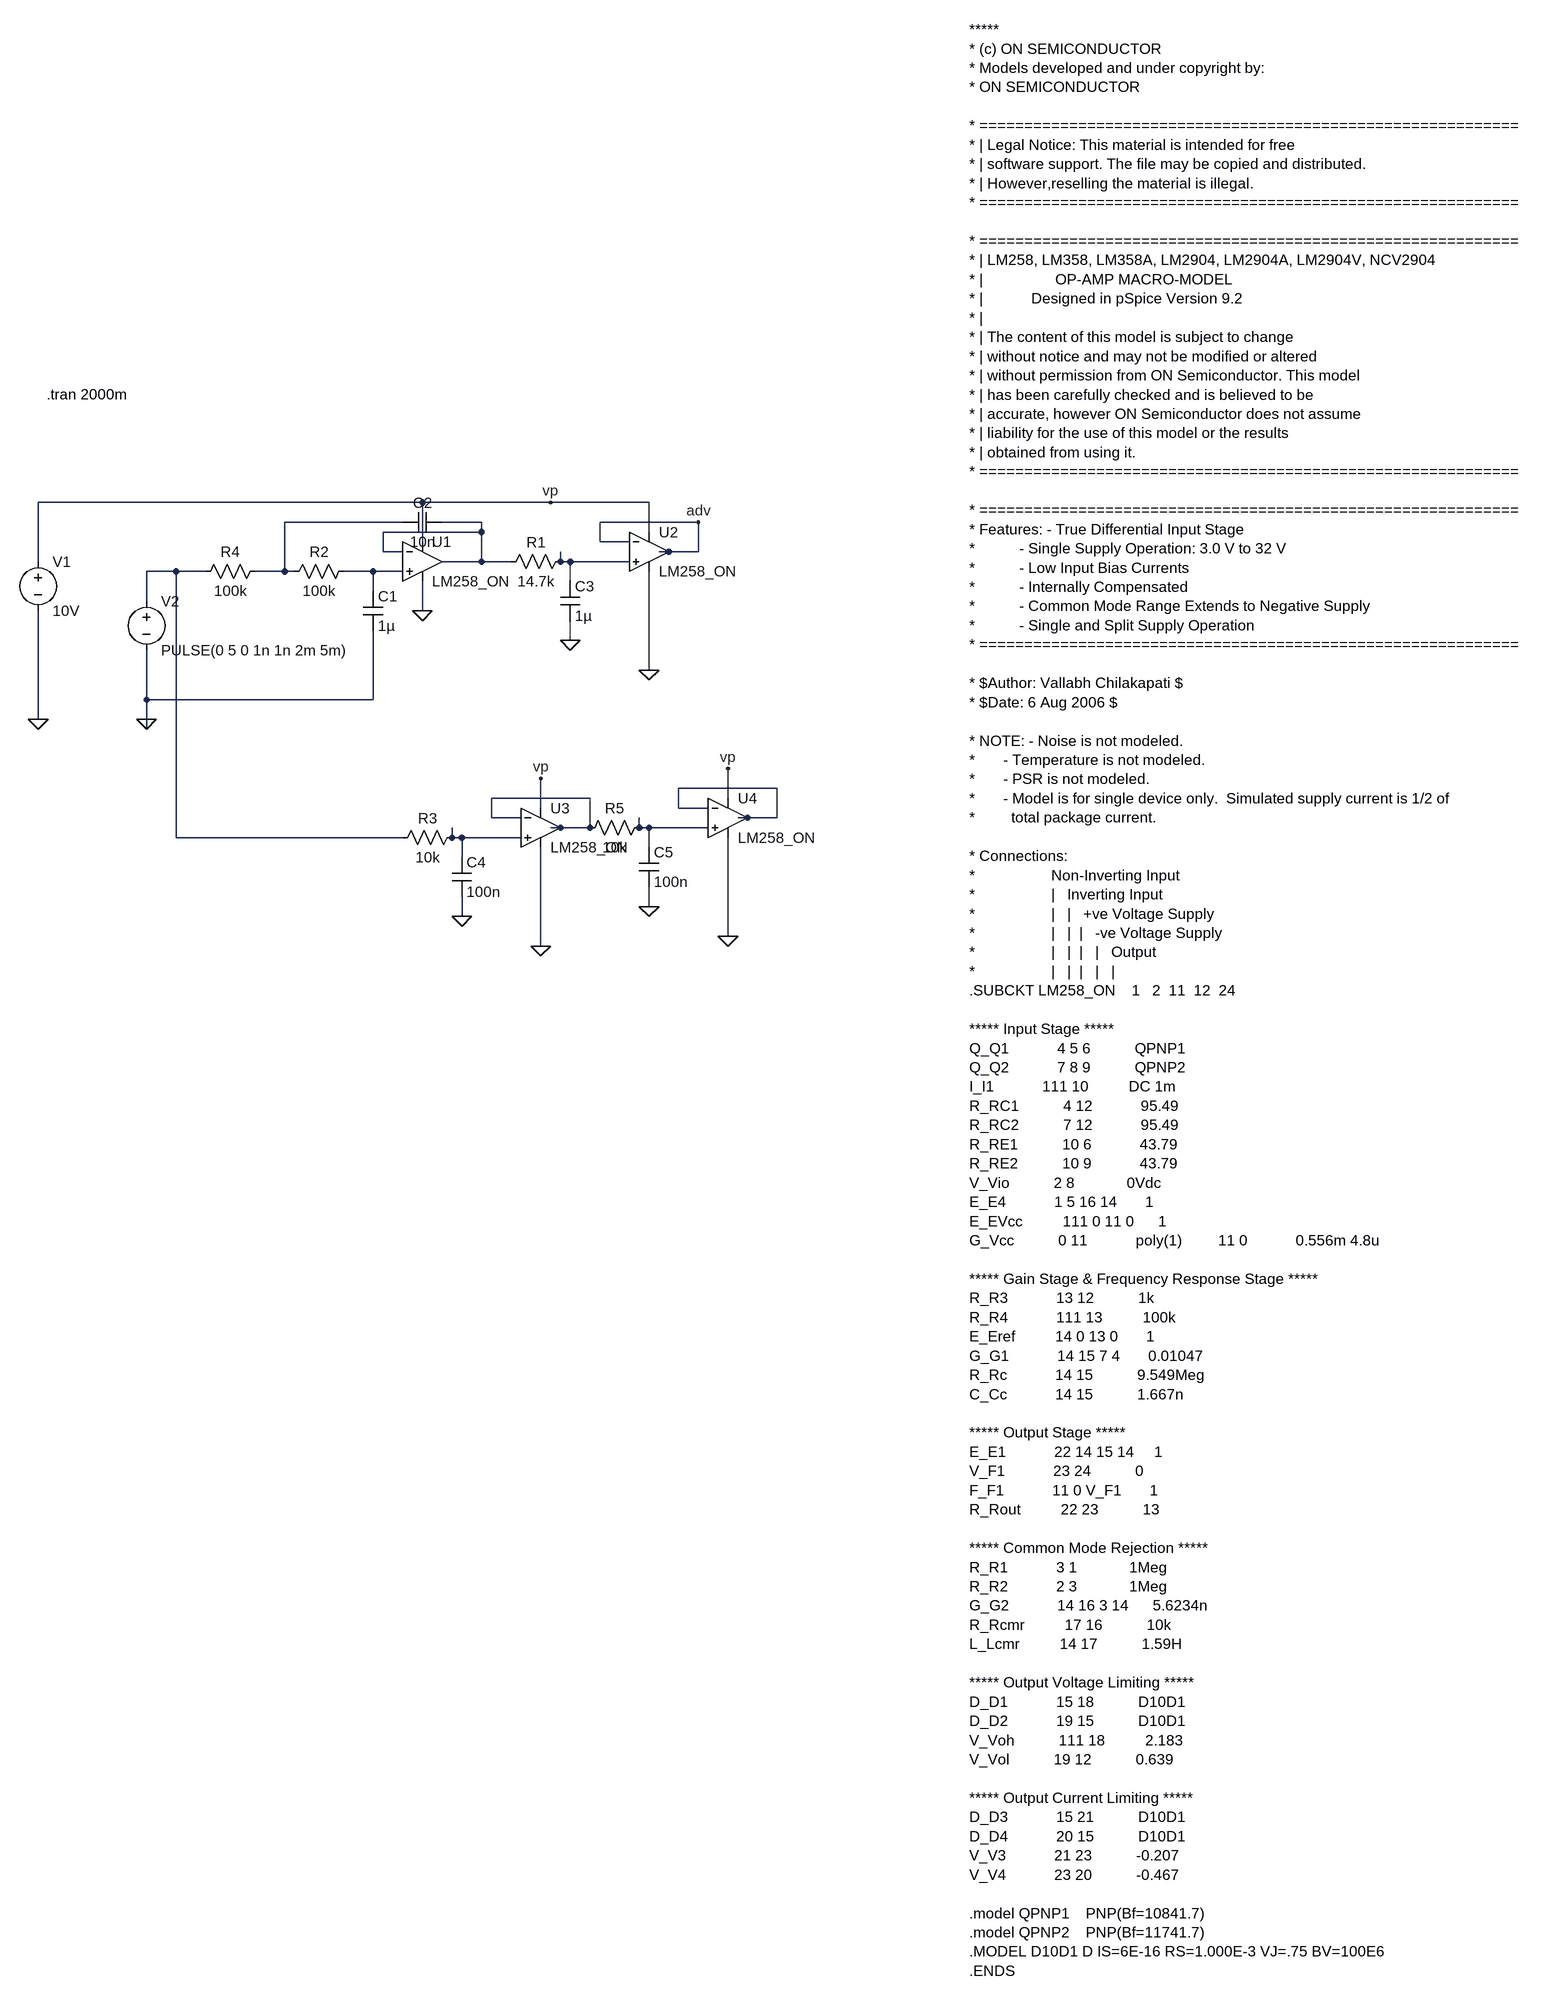
[diagram p0: schematic buckconverter_injection_filter.asc]
buckconverter_injection_filter.asc, the LTspice schematic file:
Version 4
SHEET 1 3056 2944
WIRE 1136 848 512 848
WIRE 1344 848 1136 848
WIRE 1504 848 1344 848
WIRE 1104 880 912 880
WIRE 1232 880 1168 880
WIRE 1584 880 1424 880
WIRE 1232 896 1232 880
WIRE 1232 896 1072 896
WIRE 1504 896 1504 848
WIRE 1136 912 1136 848
WIRE 1424 912 1424 880
WIRE 1472 912 1424 912
WIRE 1072 928 1072 896
WIRE 1104 928 1072 928
WIRE 1536 928 1520 928
WIRE 1584 928 1584 880
WIRE 1584 928 1536 928
WIRE 512 944 512 848
WIRE 1232 944 1232 896
WIRE 1232 944 1168 944
WIRE 1280 944 1232 944
WIRE 1360 944 1360 928
WIRE 1376 944 1360 944
WIRE 1472 944 1376 944
WIRE 736 960 688 960
WIRE 784 960 736 960
WIRE 912 960 912 880
WIRE 912 960 864 960
WIRE 928 960 912 960
WIRE 1056 960 1008 960
WIRE 1104 960 1056 960
WIRE 1376 976 1376 944
WIRE 1056 992 1056 960
WIRE 688 1008 688 960
WIRE 1136 1024 1136 976
WIRE 1376 1072 1376 1040
WIRE 1504 1120 1504 960
WIRE 688 1168 688 1088
WIRE 1056 1168 1056 1056
WIRE 1056 1168 688 1168
WIRE 512 1200 512 1024
WIRE 688 1200 688 1168
WIRE 688 1216 688 1200
WIRE 1712 1312 1552 1312
WIRE 1408 1328 1248 1328
WIRE 1632 1328 1632 1280
WIRE 1328 1344 1328 1296
WIRE 1552 1344 1552 1312
WIRE 1600 1344 1552 1344
WIRE 1248 1360 1248 1328
WIRE 1296 1360 1248 1360
WIRE 1664 1360 1648 1360
WIRE 1712 1360 1712 1312
WIRE 1712 1360 1664 1360
WIRE 1360 1376 1344 1376
WIRE 1408 1376 1408 1328
WIRE 1408 1376 1360 1376
WIRE 1488 1376 1488 1360
WIRE 1504 1376 1488 1376
WIRE 1600 1376 1504 1376
WIRE 736 1392 736 960
WIRE 1104 1392 736 1392
WIRE 1184 1392 1184 1376
WIRE 1200 1392 1184 1392
WIRE 1296 1392 1200 1392
WIRE 1504 1408 1504 1376
WIRE 1200 1424 1200 1392
WIRE 1504 1504 1504 1472
WIRE 1200 1520 1200 1488
WIRE 1632 1552 1632 1392
WIRE 1328 1568 1328 1408
FLAG 1136 1024 0
FLAG 512 1200 0
FLAG 688 1200 0
FLAG 1504 1120 0
FLAG 1376 1072 0
FLAG 1328 1568 0
FLAG 1200 1520 0
FLAG 1328 1296 vp
FLAG 1344 848 vp
FLAG 1584 880 adv
FLAG 1632 1552 0
FLAG 1504 1504 0
FLAG 1632 1280 vp
SYMBOL Opamps\\opamp2 1136 880 R0
SYMATTR InstName U1
SYMATTR Value LM258_ON
SYMBOL voltage 512 928 R0
WINDOW 123 0 0 Left 2
WINDOW 39 0 0 Left 2
SYMATTR InstName V1
SYMATTR Value 10V
SYMBOL voltage 688 992 R0
WINDOW 123 0 0 Left 2
WINDOW 39 0 0 Left 2
SYMATTR InstName V2
SYMATTR Value PULSE(0 5 0 1n 1n 2m 5m)
SYMBOL res 1024 944 R90
WINDOW 0 0 56 VBottom 2
WINDOW 3 32 56 VTop 2
SYMATTR InstName R2
SYMATTR Value 100k
SYMBOL cap 1040 992 R0
SYMATTR InstName C1
SYMATTR Value 1µ
SYMBOL cap 1168 864 R90
WINDOW 0 0 32 VBottom 2
WINDOW 3 32 32 VTop 2
SYMATTR InstName C2
SYMATTR Value 10n
SYMBOL res 1376 928 R90
WINDOW 0 0 56 VBottom 2
WINDOW 3 32 56 VTop 2
SYMATTR InstName R1
SYMATTR Value 14.7k
SYMBOL cap 1360 976 R0
SYMATTR InstName C3
SYMATTR Value 1µ
SYMBOL Opamps\\opamp2 1504 864 R0
SYMATTR InstName U2
SYMATTR Value LM258_ON
SYMBOL res 1200 1376 R90
WINDOW 0 0 56 VBottom 2
WINDOW 3 32 56 VTop 2
SYMATTR InstName R3
SYMATTR Value 10k
SYMBOL cap 1184 1424 R0
SYMATTR InstName C4
SYMATTR Value 100n
SYMBOL Opamps\\opamp2 1328 1312 R0
SYMATTR InstName U3
SYMATTR Value LM258_ON
SYMBOL res 880 944 R90
WINDOW 0 0 56 VBottom 2
WINDOW 3 32 56 VTop 2
SYMATTR InstName R4
SYMATTR Value 100k
SYMBOL res 1504 1360 R90
WINDOW 0 0 56 VBottom 2
WINDOW 3 32 56 VTop 2
SYMATTR InstName R5
SYMATTR Value 10k
SYMBOL cap 1488 1408 R0
SYMATTR InstName C5
SYMATTR Value 100n
SYMBOL Opamps\\opamp2 1632 1296 R0
SYMATTR InstName U4
SYMATTR Value LM258_ON
TEXT 2024 80 Left 2 !*****\n* (c) ON SEMICONDUCTOR\n* Models developed and under copyright by:\n* ON SEMICONDUCTOR \n \n* ============================================================\n* | Legal Notice: This material is intended for free  \n* | software support. The file may be copied and distributed. \n* | However,reselling the material is illegal.\n* ============================================================\n \n* ============================================================      \n* | LM258, LM358, LM358A, LM2904, LM2904A, LM2904V, NCV2904\n* |                  OP-AMP MACRO-MODEL\n* |            Designed in pSpice Version 9.2\n* |\n* | The content of this model is subject to change\n* | without notice and may not be modified or altered\n* | without permission from ON Semiconductor. This model\n* | has been carefully checked and is believed to be\n* | accurate, however ON Semiconductor does not assume \n* | liability for the use of this model or the results \n* | obtained from using it.\n* ============================================================\n \n* ============================================================\n* Features: - True Differential Input Stage\n*           - Single Supply Operation: 3.0 V to 32 V\n*           - Low Input Bias Currents\n*           - Internally Compensated\n*           - Common Mode Range Extends to Negative Supply\n*           - Single and Split Supply Operation\n* ============================================================\n \n* $Author: Vallabh Chilakapati $\n* $Date: 6 Aug 2006 $\n \n* NOTE: - Noise is not modeled.\n*       - Temperature is not modeled.\n*       - PSR is not modeled.\n*       - Model is for single device only.  Simulated supply current is 1/2 of\n*         total package current.\n \n* Connections:\n*                   Non-Inverting Input\n*                   |   Inverting Input\n*                   |   |   +ve Voltage Supply\n*                   |   |  |   -ve Voltage Supply\n*                   |   |  |   |   Output\n*                   |   |  |   |   |\n.SUBCKT LM258_ON    1   2  11  12  24\n \n***** Input Stage *****\nQ_Q1            4 5 6           QPNP1    \nQ_Q2            7 8 9           QPNP2\nI_I1            111 10          DC 1m\nR_RC1           4 12            95.49 \nR_RC2           7 12            95.49\nR_RE1           10 6            43.79 \nR_RE2           10 9            43.79\nV_Vio           2 8             0Vdc\nE_E4            1 5 16 14       1\nE_EVcc          111 0 11 0      1\nG_Vcc           0 11            poly(1)         11 0            0.556m 4.8u\n \n***** Gain Stage & Frequency Response Stage *****\nR_R3            13 12           1k  \nR_R4            111 13          100k  \nE_Eref          14 0 13 0       1\nG_G1            14 15 7 4       0.01047\nR_Rc            14 15           9.549Meg \nC_Cc            14 15           1.667n \n \n***** Output Stage *****\nE_E1            22 14 15 14     1\nV_F1            23 24           0\nF_F1            11 0 V_F1       1\nR_Rout          22 23           13\n \n***** Common Mode Rejection *****\nR_R1            3 1             1Meg\nR_R2            2 3             1Meg\nG_G2            14 16 3 14      5.6234n\nR_Rcmr          17 16           10k\nL_Lcmr          14 17           1.59H \n \n***** Output Voltage Limiting *****\nD_D1            15 18           D10D1\nD_D2            19 15           D10D1 \nV_Voh           111 18          2.183\nV_Vol           19 12           0.639\n \n***** Output Current Limiting *****\nD_D3            15 21           D10D1 \nD_D4            20 15           D10D1 \nV_V3            21 23           -0.207\nV_V4            23 20           -0.467\n \n.model QPNP1    PNP(Bf=10841.7)\n.model QPNP2    PNP(Bf=11741.7)\n.MODEL D10D1 D IS=6E-16 RS=1.000E-3 VJ=.75 BV=100E6\n.ENDS
TEXT 526 672 Left 2 !.tran 2000m

The netlist it stands for:
* buckconverter_injection_filter.asc
XU1 N005 N002 vp 0 N002 LM258_ON  ; pins In+ In- V+ V- OUT
V1 vp 0 10V
V2 N004 0 PULSE(0 5 0 1n 1n 2m 5m)
R2 N005 N001 100k
C1 N005 0 1µ
C2 N002 N001 10n
R1 N003 N002 14.7k
C3 N003 0 1µ
XU2 N003 adv vp 0 adv LM258_ON  ; pins In+ In- V+ V- OUT
R3 N009 N004 10k
C4 N009 0 100n
XU3 N009 N007 vp 0 N007 LM258_ON  ; pins In+ In- V+ V- OUT
R4 N001 N004 100k
R5 N008 N007 10k
C5 N008 0 100n
XU4 N008 N006 vp 0 N006 LM258_ON  ; pins In+ In- V+ V- OUT
*****
* (c) ON SEMICONDUCTOR
* Models developed and under copyright by:
* ON SEMICONDUCTOR
* ============================================================
* | Legal Notice: This material is intended for free
* | software support. The file may be copied and distributed.
* | However,reselling the material is illegal.
* ============================================================
* ============================================================
* | LM258, LM358, LM358A, LM2904, LM2904A, LM2904V, NCV2904
* |                  OP-AMP MACRO-MODEL
* |            Designed in pSpice Version 9.2
* |
* | The content of this model is subject to change
* | without notice and may not be modified or altered
* | without permission from ON Semiconductor. This model
* | has been carefully checked and is believed to be
* | accurate, however ON Semiconductor does not assume
* | liability for the use of this model or the results
* | obtained from using it.
* ============================================================
* ============================================================
* Features: - True Differential Input Stage
*           - Single Supply Operation: 3.0 V to 32 V
*           - Low Input Bias Currents
*           - Internally Compensated
*           - Common Mode Range Extends to Negative Supply
*           - Single and Split Supply Operation
* ============================================================
* $Author: Vallabh Chilakapati $
* $Date: 6 Aug 2006 $
* NOTE: - Noise is not modeled.
*       - Temperature is not modeled.
*       - PSR is not modeled.
*       - Model is for single device only.  Simulated supply current is 1/2 of
*         total package current.
* Connections:
*                   Non-Inverting Input
*                   |   Inverting Input
*                   |   |   +ve Voltage Supply
*                   |   |  |   -ve Voltage Supply
*                   |   |  |   |   Output
*                   |   |  |   |   |
.SUBCKT LM258_ON    1   2  11  12  24
***** Input Stage *****
Q_Q1            4 5 6           QPNP1
Q_Q2            7 8 9           QPNP2
I_I1            111 10          DC 1m
R_RC1           4 12            95.49
R_RC2           7 12            95.49
R_RE1           10 6            43.79
R_RE2           10 9            43.79
V_Vio           2 8             0Vdc
E_E4            1 5 16 14       1
E_EVcc          111 0 11 0      1
G_Vcc           0 11            poly(1)         11 0            0.556m 4.8u
***** Gain Stage & Frequency Response Stage *****
R_R3            13 12           1k
R_R4            111 13          100k
E_Eref          14 0 13 0       1
G_G1            14 15 7 4       0.01047
R_Rc            14 15           9.549Meg
C_Cc            14 15           1.667n
***** Output Stage *****
E_E1            22 14 15 14     1
V_F1            23 24           0
F_F1            11 0 V_F1       1
R_Rout          22 23           13
***** Common Mode Rejection *****
R_R1            3 1             1Meg
R_R2            2 3             1Meg
G_G2            14 16 3 14      5.6234n
R_Rcmr          17 16           10k
L_Lcmr          14 17           1.59H
***** Output Voltage Limiting *****
D_D1            15 18           D10D1
D_D2            19 15           D10D1
V_Voh           111 18          2.183
V_Vol           19 12           0.639
***** Output Current Limiting *****
D_D3            15 21           D10D1
D_D4            20 15           D10D1
V_V3            21 23           -0.207
V_V4            23 20           -0.467
.model QPNP1    PNP(Bf=10841.7)
.model QPNP2    PNP(Bf=11741.7)
.MODEL D10D1 D IS=6E-16 RS=1.000E-3 VJ=.75 BV=100E6
.ENDS
.tran 2000m
.backanno
.end